# EAGLE design ppmacboard (EAGLE 6.4)
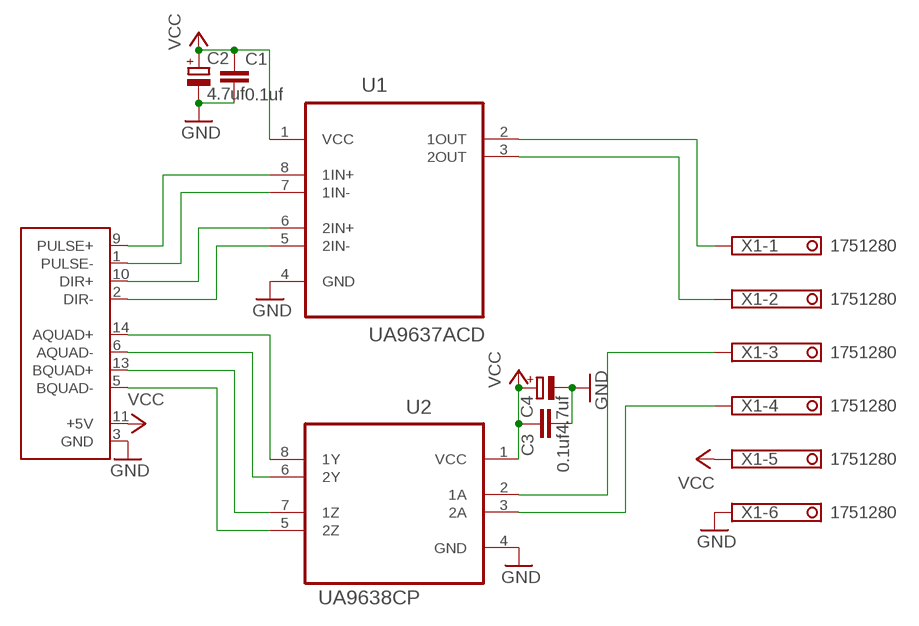
[diagram p0: schematic, sheet 1]

## Parts
C1  0.1uf  C-EUC1206  [C1206]
C2  4.7uf  CPOL-EUA/3216-18W  [A/3216-18W]
C3  0.1uf  C-EUC1206  [C1206]
C4  4.7uf  CPOL-EUA/3216-18W  [A/3216-18W]
U1  UA9637ACD  [SOIC127P600X175-8N]
U2  UA9638CP  [SOIC127P600X272-8N]
U$1  AFBPUQUOUT  [M15HP]
X1  1751280  [1751280]

## Nets
GND: C1.2 C2.- C3.2 C4.- U1.4(GND) U2.4(GND) U$1.3(GND) X1.6
N$1: U1.8(1IN+) U$1.9(PULSE+)
N$2: U1.7(1IN-) U$1.1(PULSE-)
N$3: U1.6(2IN+) U$1.10(DIR+)
N$4: U1.5(2IN-) U$1.2(DIR-)
N$5: U2.8(1Y) U$1.14(AQUAD+)
N$6: U2.6(2Y) U$1.6(AQUAD-)
N$7: U2.7(1Z) U$1.13(BQUAD+)
N$8: U2.5(2Z) U$1.5(BQUAD-)
N$9: U1.2(1OUT) X1.1
N$10: U1.3(2OUT) X1.2
N$11: U2.2(1A) X1.3
N$12: U2.3(2A) X1.4
VCC: C1.1 C2.+ C3.1 C4.+ U1.1(VCC) U2.1(VCC) U$1.11(+5V) X1.5

## Library data of the parts
C1 C3 = resistor:C-EU: CAPACITOR, European symbol; OC_NEWARK: unknown; PARTNO: C1206C104K3RACTU
C2 C4 = resistor:CPOL-EU: POLARIZED CAPACITOR, European symbol; OC_NEWARK: unknown; PARTNO: T491A475M025AT
U1 = Texas Instruments_By_element14_Batch_1:UA9637ACD: DUAL DIFFERENTIAL LINE RECEIVER; MPN: UA9637ACD; OC_FARNELL: 9593934; OC_NEWARK: 09F1539; PACKAGE: SOIC-8; SUPPLIER: Texas Instruments
U2 = copied_new_footprints:UA9638CP: DIFFERENTIAL LINE DRIVER
U$1 = ppmac:AFBPUQUOUT: PPMAC interface to a pulse and direction stepper with quadrature encoder input. Does not have fault or enable as sharing encoder lines
X1 = con-phoenix-350:1751280: MKDS 1/ 6-3,5 Printklemme Nennstrom: 10 A Bemessungsspannung: 160 V Raster: 3,5 mm Polzahl: 6 Montageart: Löten Anschlussart: Schraubanschluss Anschlussrichtung vom Leiter zur Platine: 0° Source: http://eshop.phoenixcontact.com .. 1751280.pdf; MPN: 1751280; OC_FARNELL: unknown; OC_NEWARK: 27R1765

## Board
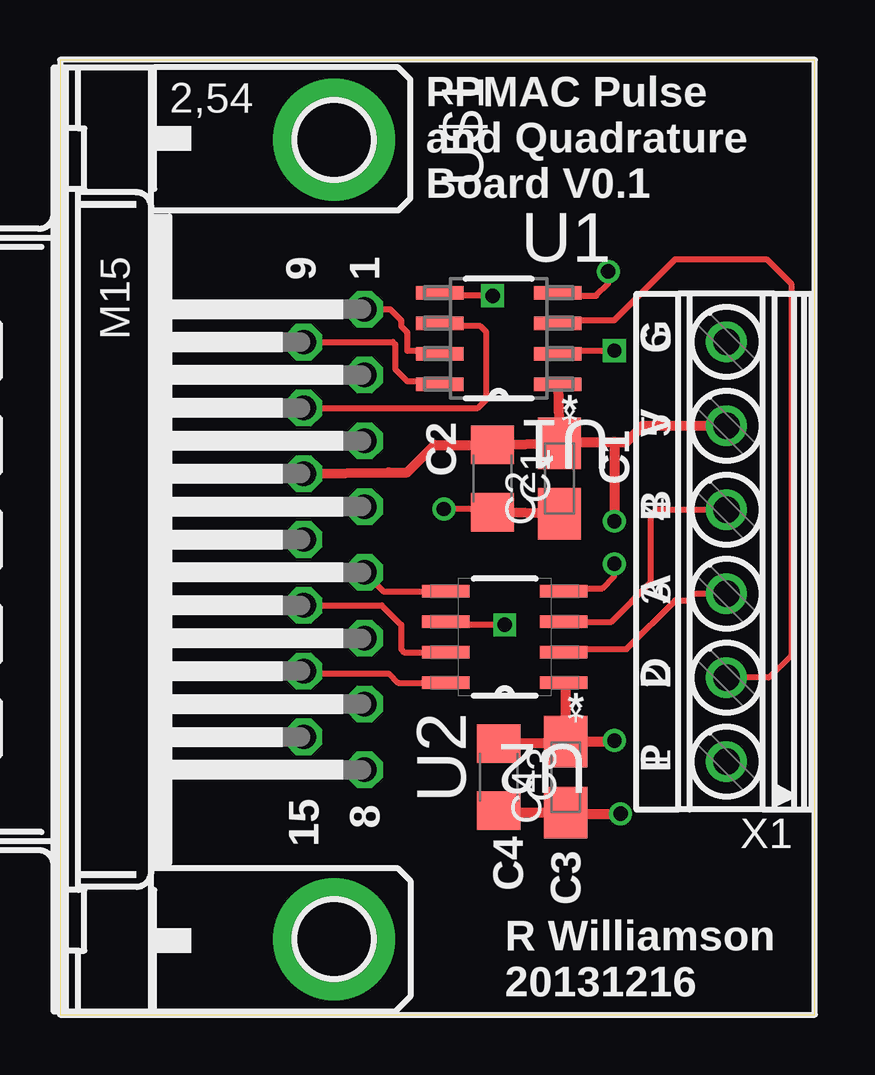
[diagram p1: board, top side]
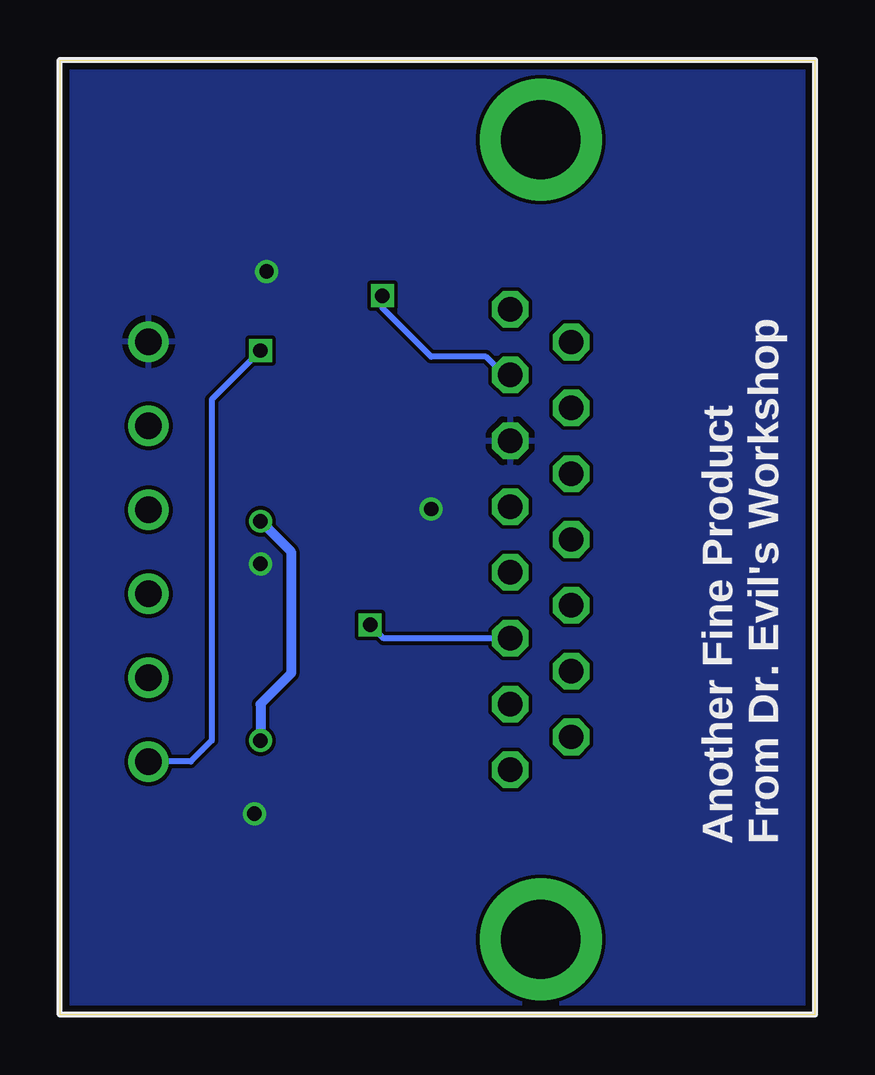
[diagram p2: board, bottom side, seen from below]

Size 31.48 x 39.8 mm. Coordinates in mm from the lower left corner, seen from the top.
Outline: 0,0 31.48,0 31.48,39.8 0,39.8 0,0
Copper layers (1*16): Top 0.0356mm / dielectric 1.5011mm / Bottom 0.0356mm
Design rules "LaenPCBOrder": minimum track width 6mil, minimum drill 13mil, track to track 6mil, track to pad 6mil, pad to pad 6mil, via to via 6mil, smd to smd 6mil, copper to edge 15mil, drill to drill 6mil, minimum pad ring 7mil, minimum via ring 7mil, stop-mask expansion 4mil, vias tented up to drill 0mil, thermal gap 10mil

### Footprints (pad centres in the part's own frame; a part is rotated, then mirrored left to right if it is on the bottom)
C1206 = smd 1.6 x 1.8: 1 -1.4,0; 2 1.4,0
A/3216-18W = smd 2.15 x 1.8: + 1.475,0; - -1.475,0
SOIC127P600X175-8N = smd 1.981 x 0.559: 1 -2.464,1.905; 2 -2.464,0.635; 3 -2.464,-0.635; 4 -2.464,-1.905; 5 2.464,-1.905; 6 2.464,-0.635; 7 2.464,0.635; 8 2.464,1.905
SOIC127P600X272-8N = smd 1.981 x 0.533: 1 -2.464,1.905; 2 -2.464,0.635; 3 -2.464,-0.635; 4 -2.464,-1.905; 5 2.464,-1.905; 6 2.464,-0.635; 7 2.464,0.635; 8 2.464,1.905
M15HP = drill 1.016 octagon: 1 -9.601,1.27; 2 -6.858,1.27; 3 -4.115,1.27; 4 -1.372,1.27; 5 1.372,1.27; 6 4.115,1.27; 7 6.858,1.27; 8 9.601,1.27; 9 -8.23,-1.27; 10 -5.486,-1.27; 11 -2.743,-1.27; 12 0,-1.27; 13 2.743,-1.27; 14 5.486,-1.27; 15 8.23,-1.27 | drill 3.302 pad 5.08: G1 -16.662,0; G2 16.662,0
1751280 = drill 1.1 pad 1.7: 1 -8.75,-0.1; 2 -5.25,-0.1; 3 -1.75,-0.1; 4 1.75,-0.1; 5 5.25,-0.1; 6 8.75,-0.1

### Placement (x,y rotation side)
C1  18.03,22.35 270 top
C2  20.83,22.35 90 top
C3  18.29,9.91 270 top
C4  21.08,9.91 90 top
U1  18.29,28.19 180 top
U2  18.54,15.75 180 top
U$1  11.43,19.81 270 top
X1  27.69,19.3 90 top

### Tracks (layer width: path | path; a pad name or v marks a point on that pad's centre or on a via)
GND  (via drill 0.6)
  Top 0.254: C1.2 17.9,21.08 v16,21.08 | U2.4 21.13,17.78 22.61,17.78 23.11,18.29 v23.11,18.8 | U1.4 20.88,29.97 22.35,29.97 22.86,30.48 v22.86,30.99
  Top 0.406: C2.- C1.2 | C3.2 18.36,8.43 C4.- 21.13,8.38 v23.37,8.38
  pour Bottom: 0,39.88 31.5,39.88 31.5,0 0,0
N$1
  Top 0.254: U$1.9 13.87,28.04 13.97,27.94 13.97,26.92 14.48,26.42 15.7,26.42 U1.8
N$2
  Top 0.254: U$1.1 13.77,29.41 14.22,28.96 14.22,28.7 14.48,28.45 14.48,27.69 15.7,27.69 U1.7
N$3
  Top 0.254: U$1.10 17.42,25.3 17.78,25.65 17.78,28.45 17.53,28.7 15.95,28.7 U1.6
N$4  (via drill 0.6)
  Top 0.254: v18.03,29.97 15.95,29.97 U1.5
  Bottom 0.254: U$1.2 12.95,26.67 13.72,27.43 16,27.43 18.03,29.46 v18.03,29.97
N$5
  Top 0.254: U$1.14 10.26,14.22 13.72,14.22 14.1,13.84 U2.8
N$6  (via drill 0.6)
  Top 0.254: v18.54,16.26 16.2,16.26 U2.6
  Bottom 0.254: U$1.6 17.98,15.7 v18.54,16.26
N$7
  Top 0.254: U$1.13 13.41,17.07 14.22,16.26 14.22,15.24 14.35,15.11 U2.7
N$8
  Top 0.254: U$1.5 13.49,17.65 U2.5
N$9  (via drill 0.6)
  Top 0.254: U1.2 20.88,27.69 v23.11,27.69
  Bottom 0.254: v23.11,27.69 25.15,25.65 25.15,11.43 26.02,10.55 X1.1
N$10
  Top 0.254: U1.3 20.88,28.96 23.11,28.96 25.65,31.5 29.46,31.5 30.48,30.48 30.48,14.99 29.55,14.05 X1.2
N$11
  Top 0.254: U2.2 21.13,15.24 23.62,15.24 25.65,17.27 26.16,17.27 26.44,17.55 X1.3
N$12
  Top 0.254: U2.3 22.99,16.38 24.64,18.03 24.64,20.83 24.86,21.05 X1.4
VCC  (via drill 0.6)
  Top 0.406: U1.1 C2.+ | C2.+ C1.1 15.62,23.75 14.48,22.61 13.72,22.61 U$1.11 | U2.1 21.08,13.77 C4.+ | C4.+ 21.01,11.31 C3.1 | C2.+ 20.88,23.88 23.11,23.88 | 23.11,23.88 23.62,23.88 24.3,24.55 X1.5 | 23.11,23.88 v23.11,20.57 | v23.11,11.43 23.07,11.38 C4.+
  Bottom 0.406: v23.11,20.57 21.84,19.3 21.84,14.22 23.11,12.95 v23.11,11.43

### Text on the board
tNames: PPMAC Pulse / and Quadrature / Board V0.1 | U1 | 9 | 1 | G | * | C1 | V | C2 | B | A | * | D | U2 | P | 15 | 8 | C3 | C4 | R Williamson / 20131216
bNames: Another Fine Product / From Dr. Evil's Workshop